# EAGLE schematic ArduinoNano LearningBot 4-2-18 (EAGLE 8.4.1)
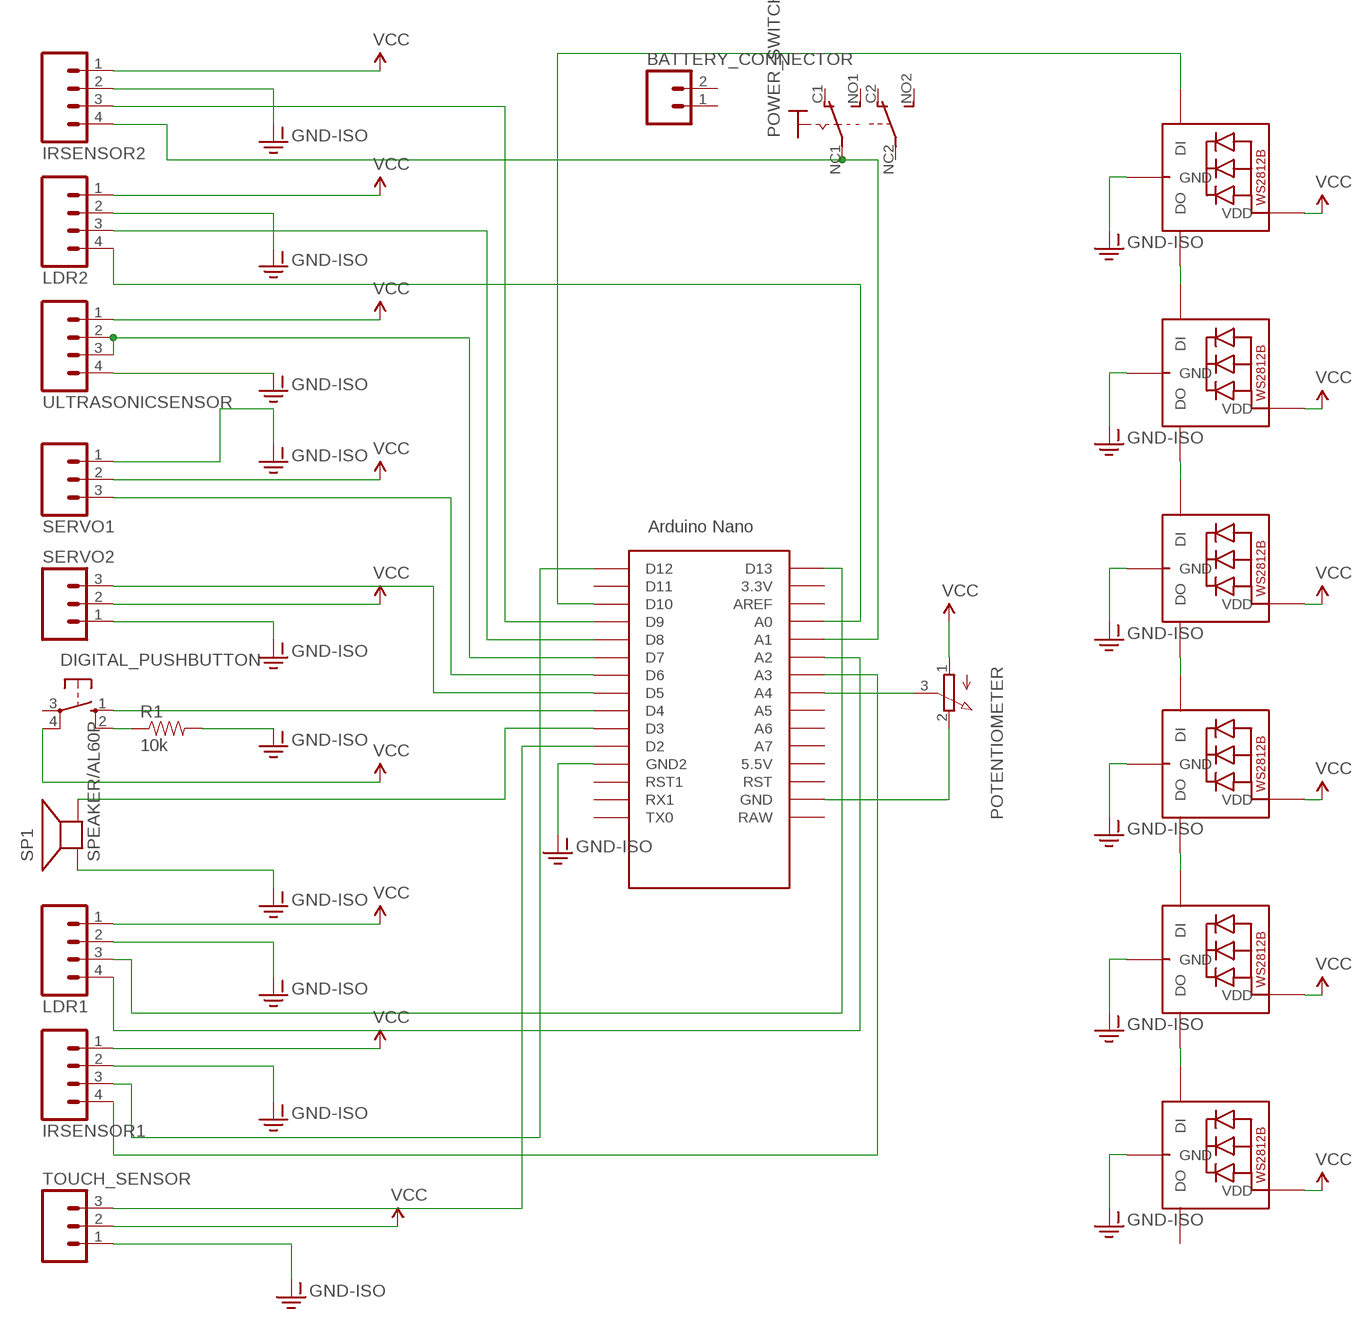
[diagram p0: schematic, sheet 1]

## Parts
BATTERY_CONNECTOR  M02-JST-2-PTH-NO_SILK  [JST-2-PTH-NS]
DIGITAL_PUSHBUTTON  10-XX  [B3F-10XX]
IRSENSOR1  M04LOCK  [1X04_LOCK]
IRSENSOR2  M04LOCK  [1X04_LOCK]
LDR1  M04LOCK  [1X04_LOCK]
LDR2  M04LOCK  [1X04_LOCK]
LED1  WS2812B5050  [WS2812B]
LED2  WS2812B5050  [WS2812B]
LED3  WS2812B5050  [WS2812B]
LED4  WS2812B5050  [WS2812B]
LED5  WS2812B5050  [WS2812B]
LED6  WS2812B5050  [WS2812B]
POTENTIOMETER  3RP/1610N-VERTICAL  [3RP/1610N-VERTICAL]
POWER_SWITCH  SWITCH_320-938  [PS22F03]
R1  10k  RESISTORPTH-1/4W  [AXIAL-0.4]
SERVO1  M03LOCK  [1X03_LOCK]
SERVO2  M03LOCK  [1X03_LOCK]
SP1  SPEAKER/AL60P  [AL60P]
TOUCH_SENSOR  M03LOCK  [1X03_LOCK]
U$1  ARDUINO-CLONE_NANO  [ARDUINO-CLONE_NANO]
ULTRASONICSENSOR  M04LOCK  [1X04_LOCK]

## Nets
DIGITAL_PUSHBUTTON_PIN: DIGITAL_PUSHBUTTON.1(S) U$1.D4
GND: IRSENSOR1.2 IRSENSOR2.2 LDR1.2 LDR2.2 LED1.3-GND(GND) LED2.3-GND(GND) LED3.3-GND(GND) LED4.3-GND(GND) LED5.3-GND(GND) LED6.3-GND(GND) POTENTIOMETER.2(E) R1.P$2 SERVO1.1 SERVO2.1 SP1.1(+) TOUCH_SENSOR.1 U$1.GND U$1.GND1(GND2) ULTRASONICSENSOR.4 ; supply symbol labelled GND-ISO
IR_SENSOR1_AO: IRSENSOR1.4 U$1.A3
IR_SENSOR1_DO: IRSENSOR1.3 U$1.D12
IR_SENSOR2_AO: IRSENSOR2.4 POWER_SWITCH.NC1(1:P) U$1.A1
IR_SENSOR2_DO: IRSENSOR2.3 U$1.D9
LDR1_AO: LDR1.4 U$1.A2
LDR1_DO: LDR1.3 U$1.D13
LDR2_AO: LDR2.4 U$1.A0
LDR2_DO: LDR2.3 U$1.D8
N$1: LED2.4-DIN(DI) U$1.D10
N$2: LED1.4-DIN(DI) LED2.2-DOUT(DO)
N$3: DIGITAL_PUSHBUTTON.2(S1) R1.P$1
N$4: LED1.2-DOUT(DO) LED4.4-DIN(DI)
N$5: LED4.2-DOUT(DO) LED6.4-DIN(DI)
N$6: LED3.4-DIN(DI) LED6.2-DOUT(DO)
N$7: POTENTIOMETER.3(S) U$1.A4
N$8: LED3.2-DOUT(DO) LED5.4-DIN(DI)
SERVO1_PIN: SERVO1.3 U$1.D6
SERVO2_PIN: SERVO2.3 U$1.D5
SPEAKERPIN: SP1.2(-) U$1.D3
TOUCH_SENSOR: TOUCH_SENSOR.3 U$1.D2
ULTRASONICSENSOR_PIN: U$1.D7 ULTRASONICSENSOR.2 ULTRASONICSENSOR.3
VCC: DIGITAL_PUSHBUTTON.4(P1) IRSENSOR1.1 IRSENSOR2.1 LDR1.1 LDR2.1 LED1.1-VDD(VDD) LED2.1-VDD(VDD) LED3.1-VDD(VDD) LED4.1-VDD(VDD) LED5.1-VDD(VDD) LED6.1-VDD(VDD) POTENTIOMETER.1(A) SERVO1.2 SERVO2.2 TOUCH_SENSOR.2 ULTRASONICSENSOR.1
Unconnected: BATTERY_CONNECTOR.1 BATTERY_CONNECTOR.2 DIGITAL_PUSHBUTTON.3(P) LED5.2-DOUT(DO) POWER_SWITCH.C1(1:O) POWER_SWITCH.C2(B:O) POWER_SWITCH.NC2(B:P) POWER_SWITCH.NO1(1:S) POWER_SWITCH.NO2(B:S) U$1.3.3V U$1.5V(5.5V) U$1.A5 U$1.A6 U$1.A7 U$1.AREF U$1.D11 U$1.RAW U$1.RST U$1.RST1 U$1.RX1 U$1.TX0

## Library data of the parts
BATTERY_CONNECTOR = SparkFun-Connectors:M02: Standard 2-pin 0.1" header. Use with - straight break away headers ( PRT-00116) - right angle break away headers (PRT-00553) - swiss pins (PRT-00743) - machine pins (PRT-00117) - female headers (PRT-00115) Molex polarized connector foot print use with: PRT-08233 with associated crimp pins and housings. 2.54_SCREWTERM for use with PRT-10571. 3.5mm Screw Terminal footprints for PRT-08084 5mm Screw Terminal footprints for use with PRT-08432
DIGITAL_PUSHBUTTON = switch-omron:10-XX: OMRON SWITCH; MPN: B3F-1000; OC_FARNELL: 176432; OC_NEWARK: 36M3542
IRSENSOR1 IRSENSOR2 LDR1 LDR2 ULTRASONICSENSOR = SparkFun-Connectors:M04: Header 4 Standard 4-pin 0.1" header. Use with straight break away headers (SKU : PRT-00116), right angle break away headers (PRT-00553), swiss pins (PRT-00743), machine pins (PRT-00117), and female headers (PRT-00115). Molex polarized connector foot print use with SKU : PRT-08231 with associated crimp pins and housings. 1MM SMD Version SKU: PRT-10208; PROD_ID: CONN-09696
LED1-LED6 = adafruit:WS2812B
POTENTIOMETER = pot:3RP/1610N-VERTICAL: 16mm Potentiometer one level Source: http://www.alphapotentiometers.net/html/16mm_pot_2.html
POWER_SWITCH = ArduinoNano LearningBot 3-15-18:SWITCH_320-938: TOGGLE SWITCH distributor RS Components
R1 = SparkFun-Passives:RESISTOR: Resistor Basic schematic elements and footprints for 0603, 1206, and PTH resistors.
SERVO1 SERVO2 TOUCH_SENSOR = SparkFun-Connectors:M03: Header 3 Standard 3-pin 0.1" header. Use with straight break away headers (SKU : PRT-00116), right angle break away headers (PRT-00553), swiss pins (PRT-00743), machine pins (PRT-00117), and female headers (PRT-00115). Molex polarized connector foot print use with SKU : PRT-08232 with associated crimp pins and housings.
SP1 = adafruit:SPEAKER: SPEAKER Source: Buerklin Added PS12 (for part # PS1240 piezo) http://www.ladyada.net/library/pcb/eaglelibrary.html
U$1 = ArduinoNano LearningBot 3-15-18:ARDUINO-CLONE_NANO: Arduino Nano